# Altium schematic sheet slpMon.SchDoc
size A4
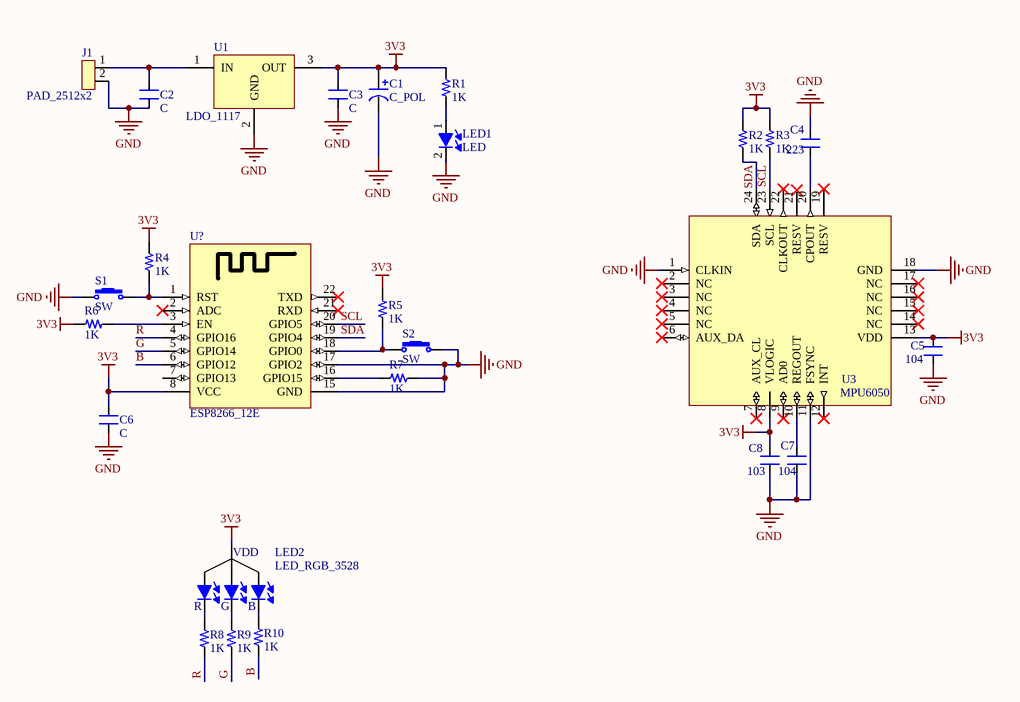
[diagram p0: slpMon.SchDoc]

## Parts
C1  C_POL  [SMD_TANTAL_2917]
C2  C  [SMD_RC_0603]
C3  C  [SMD_RC_0603]
C4  223  [SMD_RC_0603]
C5  104  [SMD_RC_0603]
C6  C  [SMD_RC_0603]
C7  104  [SMD_RC_0603]
C8  103  [SMD_RC_0603]
J1  PAD_2512x2  [PAD_2512x2]
LED1  LED  [SMD_LED_0603]
LED2  LED_RGB_3528  [SMD_LED_RGB_3528]
R1  1K  [SMD_RC_0603]
R2  1K  [SMD_RC_0603]
R3  1K  [SMD_RC_0603]
R4  1K  [SMD_RC_0603]
R5  1K  [SMD_RC_0603]
R6  1K  [SMD_RC_0603]
R7  1K  [SMD_RC_0603]
R8  1K  [SMD_RC_0603]
R9  1K  [SMD_RC_0603]
R10  1K  [SMD_RC_0603]
S1  SW  [SW_SMD_1]
S2  SW  [SW_SMD_1]
U1  LDO_1117  [SOT-223]
U3  MPU6050  [QUAD_24_EXTENDED]
U?  ESP8266_12E  [ESP8266_ESP12E_SIMPLER]

## Nets
3V3: C1.1 C3.2 C5.2 C6.2 C8.2 LED2.2(VDD) R1.2 R2.2 R3.2 R4.2 R5.1 R6.2 U1.3(OUT) U3.8(VLOGIC) U3.13(VDD) U?.8(VCC)
GND: C1.2 C2.1 C3.1 C4.2 C5.1 C6.1 C7.1 C8.1 J1.2 LED1.2 R7.1 S1.1 S2.2 U1.2(GND) U3.1(CLKIN) U3.11(FSYNC) U3.18(GND) U?.15(GND) U?.17(GPIO2)
B: R10.1 U?.6(GPIO12)
G: R9.1 U?.5(GPIO14)
R: R8.1 U?.4(GPIO16)
SCL: R3.1 U3.23(SCL) U?.20(GPIO5)
SDA: R2.1 U3.24(SDA) U?.19(GPIO4)
NetC2_2: C2.2 J1.1 U1.1(IN)
NetC4_1: C4.1 U3.20(CPOUT)
NetC7_2: C7.2 U3.10(REGOUT)
NetLED1_1: LED1.1 R1.1
NetLED2_1: LED2.1(RED) R8.2
NetLED2_3: LED2.3(BLUE) R10.2
NetLED2_4: LED2.4(GREEN) R9.2
NetR4_1: R4.1 S1.2 U?.1(RST)
NetR5_2: R5.2 S2.1 U?.18(GPIO0)
NetR6_1: R6.1 U?.3(EN)
NetR7_2: R7.2 U?.16(GPIO15)

Not connected (* = marked no-connect by the designer): U3 2(NC)* 3(NC)* 4(NC)* 5(NC)* 6(AUX_DA)* 7(AUX_CL)* 9(AD0)* 12(INT)* 14(NC)* 15(NC)* 16(NC)* 17(NC)* 19(RESV)* 21(RESV) 22(CLKOUT)*; U? 2(ADC)* 7(GPIO13) 21(RXD)* 22(TXD)*

## Notes on the sheet
- (in symbol LED_RGB_3528) R; G; B

## Library data of the parts
C4 C5 C7 C8 = C
R1-R10 = R
U? = ESP8266_ESP12E_SIMPLER
LED2 = LED_RGB_3528: ComponentLink1Description: LED 3528 - TGIC; ComponentLink1URL: https://thegioiic.com/products/led-rgb-3528
S1 S2 = SW: ComponentLink1Description: TheGioiIC; ComponentLink1URL: https://thegioiic.com/products/nut-nhan-3x4-cao-2-5mm-2pin-smd